# Altium schematic sheet ADC_IN.SchDoc
size A4
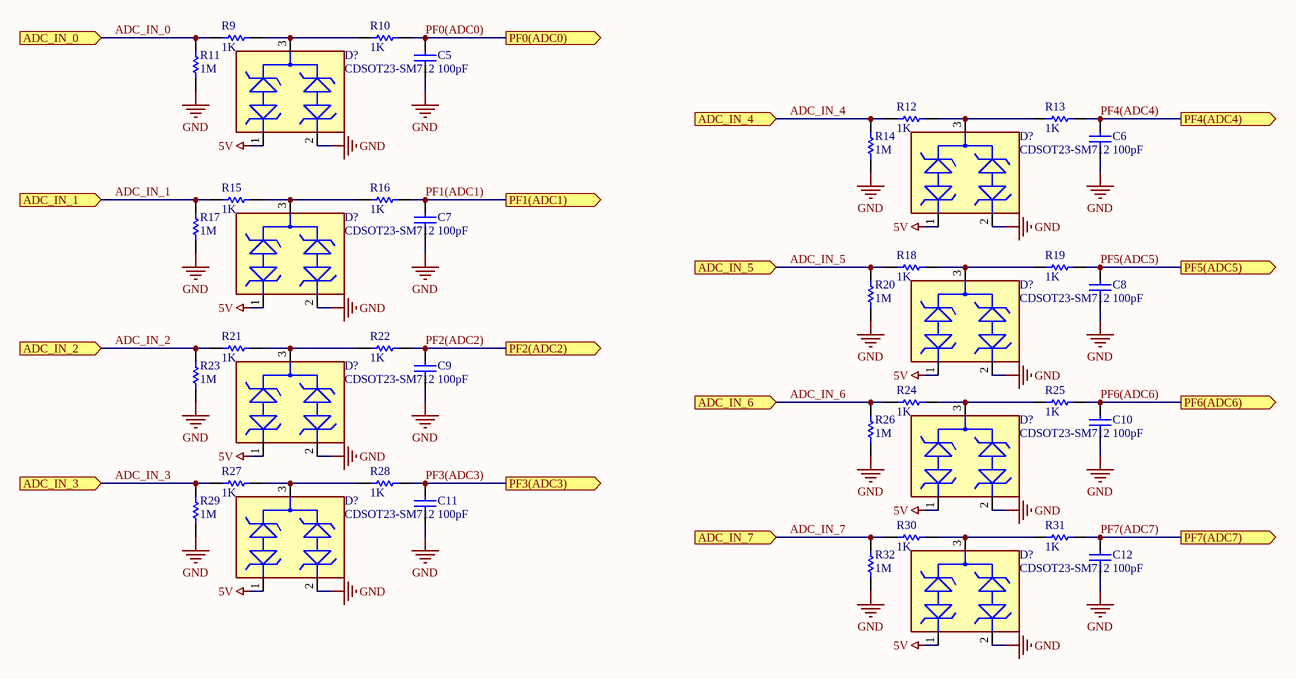
[diagram p0: ADC_IN.SchDoc]

## Parts
(Parts that share a designator on the sheet are numbered #1, #2 ... from top to bottom, then left to right.)
C5  100pF  [C2012]
C6  100pF  [C2012]
C7  100pF  [C2012]
C8  100pF  [C2012]
C9  100pF  [C2012]
C10  100pF  [C2012]
C11  100pF  [C2012]
C12  100pF  [C2012]
D?#1  CDSOT23-SM712  [FP-SOT23-MFG]
D?#2  CDSOT23-SM712  [FP-SOT23-MFG]
D?#3  CDSOT23-SM712  [FP-SOT23-MFG]
D?#4  CDSOT23-SM712  [FP-SOT23-MFG]
D?#5  CDSOT23-SM712  [FP-SOT23-MFG]
D?#6  CDSOT23-SM712  [FP-SOT23-MFG]
D?#7  CDSOT23-SM712  [FP-SOT23-MFG]
D?#8  CDSOT23-SM712  [FP-SOT23-MFG]
R9  1K  [R2012]
R10  1K  [R2012]
R11  1M  [R2012]
R12  1K  [R2012]
R13  1K  [R2012]
R14  1M  [R2012]
R15  1K  [R2012]
R16  1K  [R2012]
R17  1M  [R2012]
R18  1K  [R2012]
R19  1K  [R2012]
R20  1M  [R2012]
R21  1K  [R2012]
R22  1K  [R2012]
R23  1M  [R2012]
R24  1K  [R2012]
R25  1K  [R2012]
R26  1M  [R2012]
R27  1K  [R2012]
R28  1K  [R2012]
R29  1M  [R2012]
R30  1K  [R2012]
R31  1K  [R2012]
R32  1M  [R2012]

## Ports
ADC_IN_0 (in), ADC_IN_1 (in), ADC_IN_2 (in), ADC_IN_3 (in), ADC_IN_4 (in), ADC_IN_5 (in), ADC_IN_6 (in), ADC_IN_7 (in), PF0(ADC0) (out), PF1(ADC1) (out), PF2(ADC2) (out), PF3(ADC3) (out), PF4(ADC4) (out), PF5(ADC5) (out), PF6(ADC6) (out), PF7(ADC7) (out)

## Nets
5V: D?#1.1 D?#2.1 D?#3.1 D?#4.1 D?#5.1 D?#6.1 D?#7.1 D?#8.1
GND: C5.2 C6.2 C7.2 C8.2 C9.2 C10.2 C11.2 C12.2 D?#1.2 D?#2.2 D?#3.2 D?#4.2 D?#5.2 D?#6.2 D?#7.2 D?#8.2 R11.2 R14.2 R17.2 R20.2 R23.2 R26.2 R29.2 R32.2
ADC_IN_0: R9.2 R11.1 ; port ADC_IN_0
ADC_IN_1: R15.2 R17.1 ; port ADC_IN_1
ADC_IN_2: R21.2 R23.1 ; port ADC_IN_2
ADC_IN_3: R27.2 R29.1 ; port ADC_IN_3
ADC_IN_4: R12.2 R14.1 ; port ADC_IN_4
ADC_IN_5: R18.2 R20.1 ; port ADC_IN_5
ADC_IN_6: R24.2 R26.1 ; port ADC_IN_6
ADC_IN_7: R30.2 R32.1 ; port ADC_IN_7
PF0(ADC0): C5.1 R10.1 ; port PF0(ADC0)
PF1(ADC1): C7.1 R16.1 ; port PF1(ADC1)
PF2(ADC2): C9.1 R22.1 ; port PF2(ADC2)
PF3(ADC3): C11.1 R28.1 ; port PF3(ADC3)
PF4(ADC4): C6.1 R13.1 ; port PF4(ADC4)
PF5(ADC5): C8.1 R19.1 ; port PF5(ADC5)
PF6(ADC6): C10.1 R25.1 ; port PF6(ADC6)
PF7(ADC7): C12.1 R31.1 ; port PF7(ADC7)
NetD?#1_3: D?#1.3 R9.1 R10.2
NetD?#2_3: D?#2.3 R12.1 R13.2
NetD?#3_3: D?#3.3 R15.1 R16.2
NetD?#4_3: D?#4.3 R18.1 R19.2
NetD?#5_3: D?#5.3 R21.1 R22.2
NetD?#6_3: D?#6.3 R24.1 R25.2
NetD?#7_3: D?#7.3 R27.1 R28.2
NetD?#8_3: D?#8.3 R30.1 R31.2

## Notes on the sheet
- Title
- Size:
- Date:
- A4
- Number:
- Time:
- Revision:
- Sheet
- of
- File:

## Library data of the parts
C5-C12 = CAP: Manufacturer: AVX Interconnect / Elco; Part Number: 08051A102JAT2A
D?#1-D?#8 = CMP-2000-05081-2: TVS DIODE 7V/12V 14V/26V SOT23-3; Manufacturer: Bourns Inc.; Manufacturer: Bourns; Peak Pulse Current: 17A; Standoff Height: 0.05mm; Breakdown Voltage: 7.5V; Direction: Bidirectional; Description: 26V, 14V Clamp 17A (8/20µs) Ipp Tvs Diode Surface Mount SOT-23-3; Clamping Voltage: 26V; Value: 75pF; Number Of Channels: 2; Reverse Standoff Voltage: 12V; Peak Pulse Power: 400W; Temperature Range Low: -55°C; Mouser Description: Transient Voltage Suppressor, TVS, CDSOT23 Series, Unidirectional, 12 V, SOT-23, 3, 13.3 V; Device Class L3: unset; Package: SOT23; Height: 1.17mm; RoHS: TRUE; Octopart: https://octopart.com/cdsot23-sm712-bourns-7576327; Category: Diode; Ipc Land Pattern Name: SOT95P229X103-3; ComponentLink2URL: https://www.bourns.com/docs/Product-Datasheets/CDSOT23-SM712.pdf; Temperature Range High: +150°C; ComponentLink2Description: Datasheet; Digikey Description: TVS DIODE 7V/12V 14V/26V SOT23-3; Manufacturer Part Number: CDSOT23-SM712; Temperature: -55°C to +150°C; Device Class L2: TVS Diodes; Lead Free: Yes; Device Class L1: Circuit Protection; Automotive: No; Capacitance: 75pF
R9-R32 = RES-2: Chip Resistor, 4.7 KOhm, +/- 1%, 0.125 W, -55 to 155 degC, 0805 (2012 Metric), RoHS, Tape and Reel; Manufacturer: Vishay Semiconductor; Temperature Coefficient: 100ppm/degreesC; Voltage Rating: 150V; Max Power Dissipation: 125mW; Packaging: TapeandReel; Max Operating Temperature: 155degC; Case Code (Imperial): 0805; Case/Package: 0805; Radiation Hardening: No; Package Reference: 0805; Lead Free: LeadFree; Package Description: 2-Pin Surface Mount Device, Body 2.05 x 1.25 mm; Manufacturer URL: http://www.vishay.com/; Tolerance: 1%; Height: 0.45mm; REACH SVHC: Unknown; Termination: SMD/SMT; Length: 2mm; Depth: 1.25mm; Case Code (Metric): 2012; Package Quantity: 10; Weight: 0.000194oz; Military Standard: Not; RoHSCompliant: true; Composition: ThickFilm; Contact Plating: Tin; Datasheet Version: 41061.0; Datasheet URL: https://datasheet.ciiva.com/11808/0900766b80d98b26-11808992.pdf; Width: 1.25mm; Number of Terminations: 2; Min Operating Temperature: -55degC; Power Rating: 125mW; Resistance: 4.7KOhm; Voltage Rating (DC): 150V